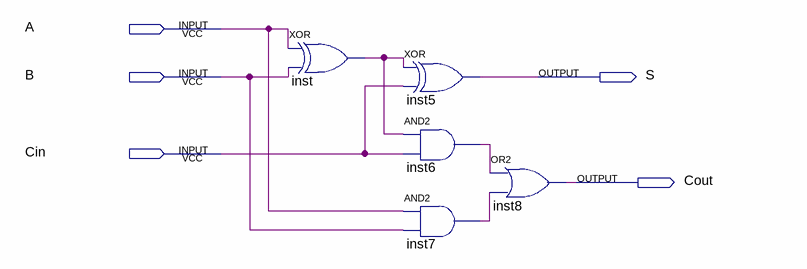
[diagram p0: schematic sheet]
// Quartus schematic Full_Adder.bdf as structural Verilog: 5 symbols, 5 pins
module Full_Adder (
  input  A,
  input  B,
  input  Cin,
  output S,
  output Cout
);

  wire inst6_out, inst7_out, inst_out;

  xor inst (inst_out, A, B);
  xor inst5 (S, inst_out, Cin);
  and inst6 (inst6_out, inst_out, Cin);
  and inst7 (inst7_out, A, B);
  or inst8 (Cout, inst6_out, inst7_out);
endmodule
